# Altium schematic sheet 1_P1.schdoc.schdoc
size 309 x 223 mm; Symbol: Sheet-Symbol_A4; Device: Sheet-Symbol_A4; @Page Name: P1; @Create Date: 2023-11-24; @Page Count: 1; @Page No: 1; @Project Name: TrackPad; @Schematic Name: Schematic1; @Update Date: 2023-11-24; Company: 嘉立创EDA; Page Size: A4; Version: V1.0
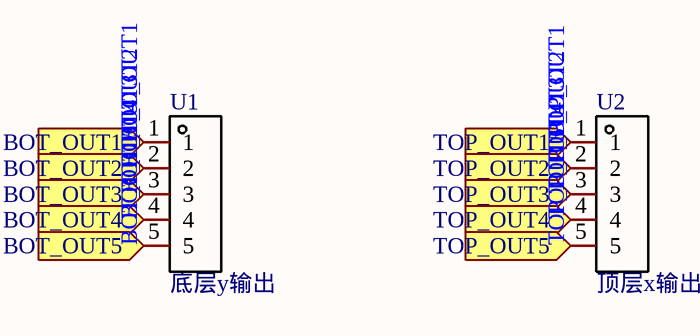
[diagram p0: 1_P1.schdoc.schdoc]

## Parts
U1  底层y输出  [HDR-TH_5P-P2.54-V-M-A]
U2  顶层x输出  [HDR-TH_5P-P2.54-V-M-A]

## Ports
BOT_OUT1 (in), BOT_OUT2 (in), BOT_OUT3 (in), BOT_OUT4 (in), BOT_OUT5 (in), TOP_OUT1 (in), TOP_OUT2 (in), TOP_OUT3 (in), TOP_OUT4 (in), TOP_OUT5 (in)

## Nets
BOT_OUT1: U1.1 ; port BOT_OUT1
BOT_OUT2: U1.2 ; port BOT_OUT2
BOT_OUT3: U1.3 ; port BOT_OUT3
BOT_OUT4: U1.4 ; port BOT_OUT4
BOT_OUT5: U1.5 ; port BOT_OUT5
TOP_OUT1: U2.1 ; port TOP_OUT1
TOP_OUT2: U2.2 ; port TOP_OUT2
TOP_OUT3: U2.3 ; port TOP_OUT3
TOP_OUT4: U2.4 ; port TOP_OUT4
TOP_OUT5: U2.5 ; port TOP_OUT5

## Notes on the sheet
- 1
- 2
- 3
- 4
- 5
- 6
- A
- B
- C
- 原理图
- Schematic1
- 创建日期
- 更新日期
- 2023-11-24
- 审阅
- 绘制
- 图页
- P1
- 物料编码
- TrackPad
- D
- 版本
- 尺寸
- 页
- 共
- V1.0
- A4
- 嘉立创EDA

## Library data of the parts
U1 U2 = 双塑单排排针5PIN2.54间距: Add into BOM: yes; Symbol: 双塑单排排针5PIN2.54间距; Device: 双塑单排排针5PIN2.54间距; LCSC Part Name: 双塑单排排针5PIN2.54间距; Supplier Part: C9900029195; Supplier Footprint: SIP-5; JLCPCB Part Class: 扩展库; Datasheet: https://atta.szlcsc.comnull; Supplier: LCSC; Convert to PCB: yes
  U1: Name: 底层y输出; Manufacturer Part: 底层y输出
  U2: Name: 顶层x输出; Manufacturer Part: 顶层x输出